# EAGLE design Sifteo Thundercracker Buddy Dev - SST (EAGLE 5.11)
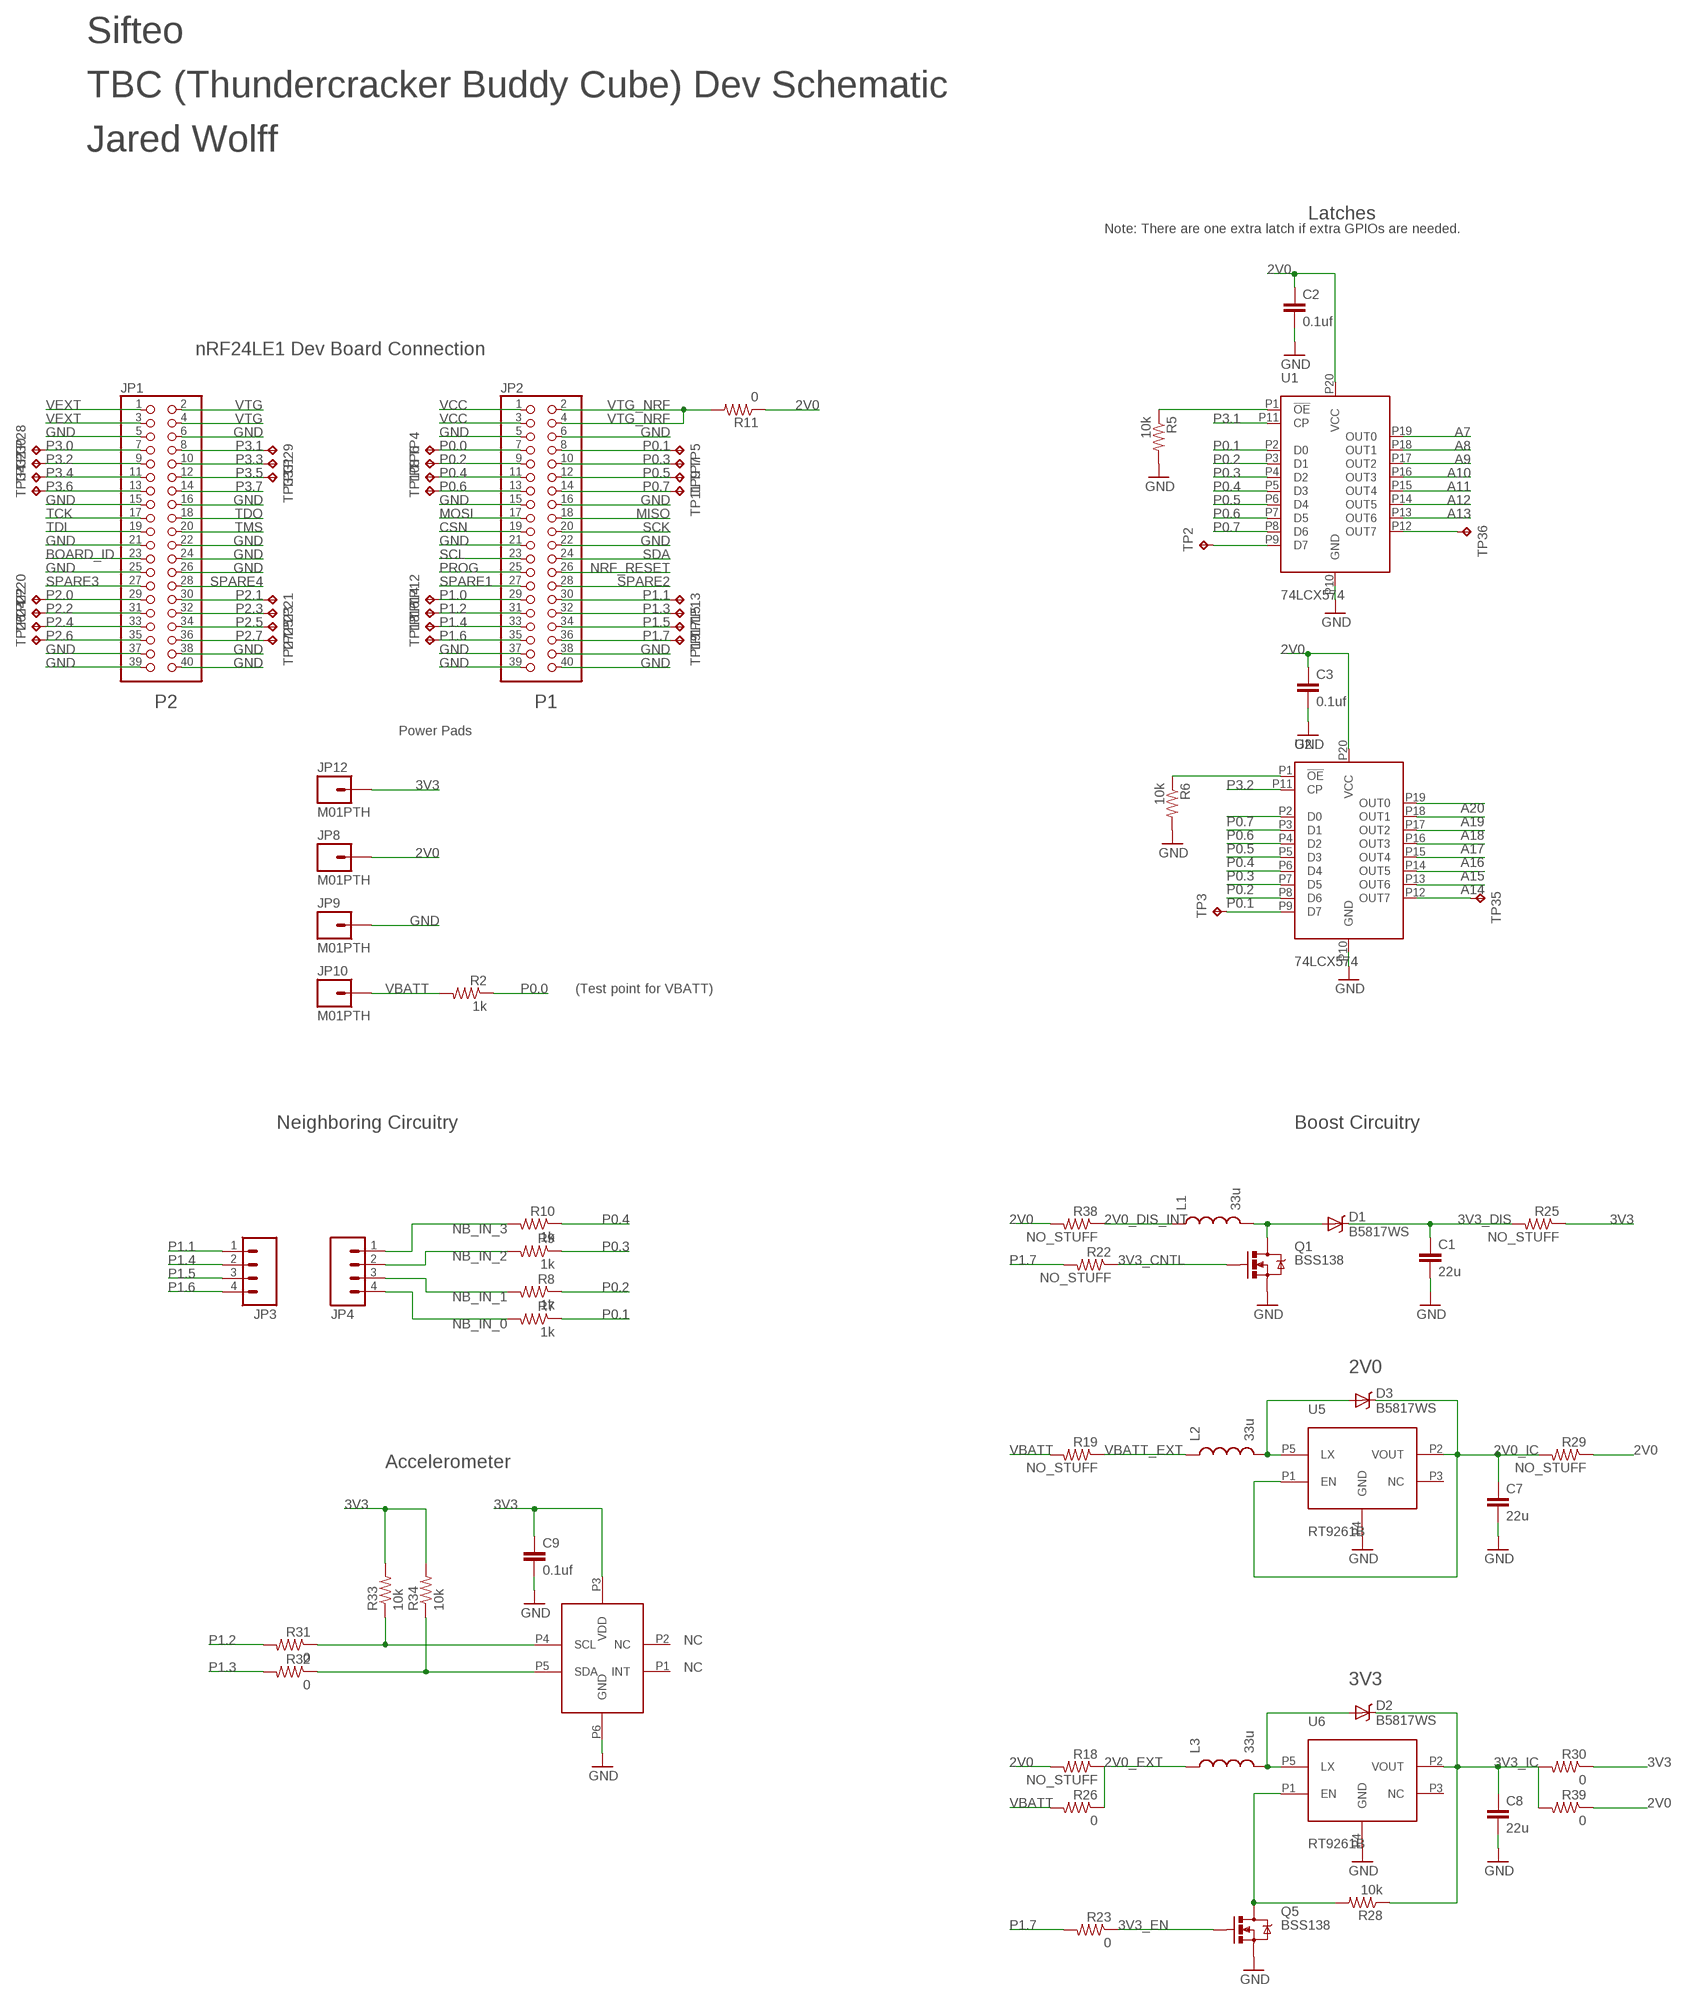
[diagram p0: schematic, sheet 1, part 1 of 2]
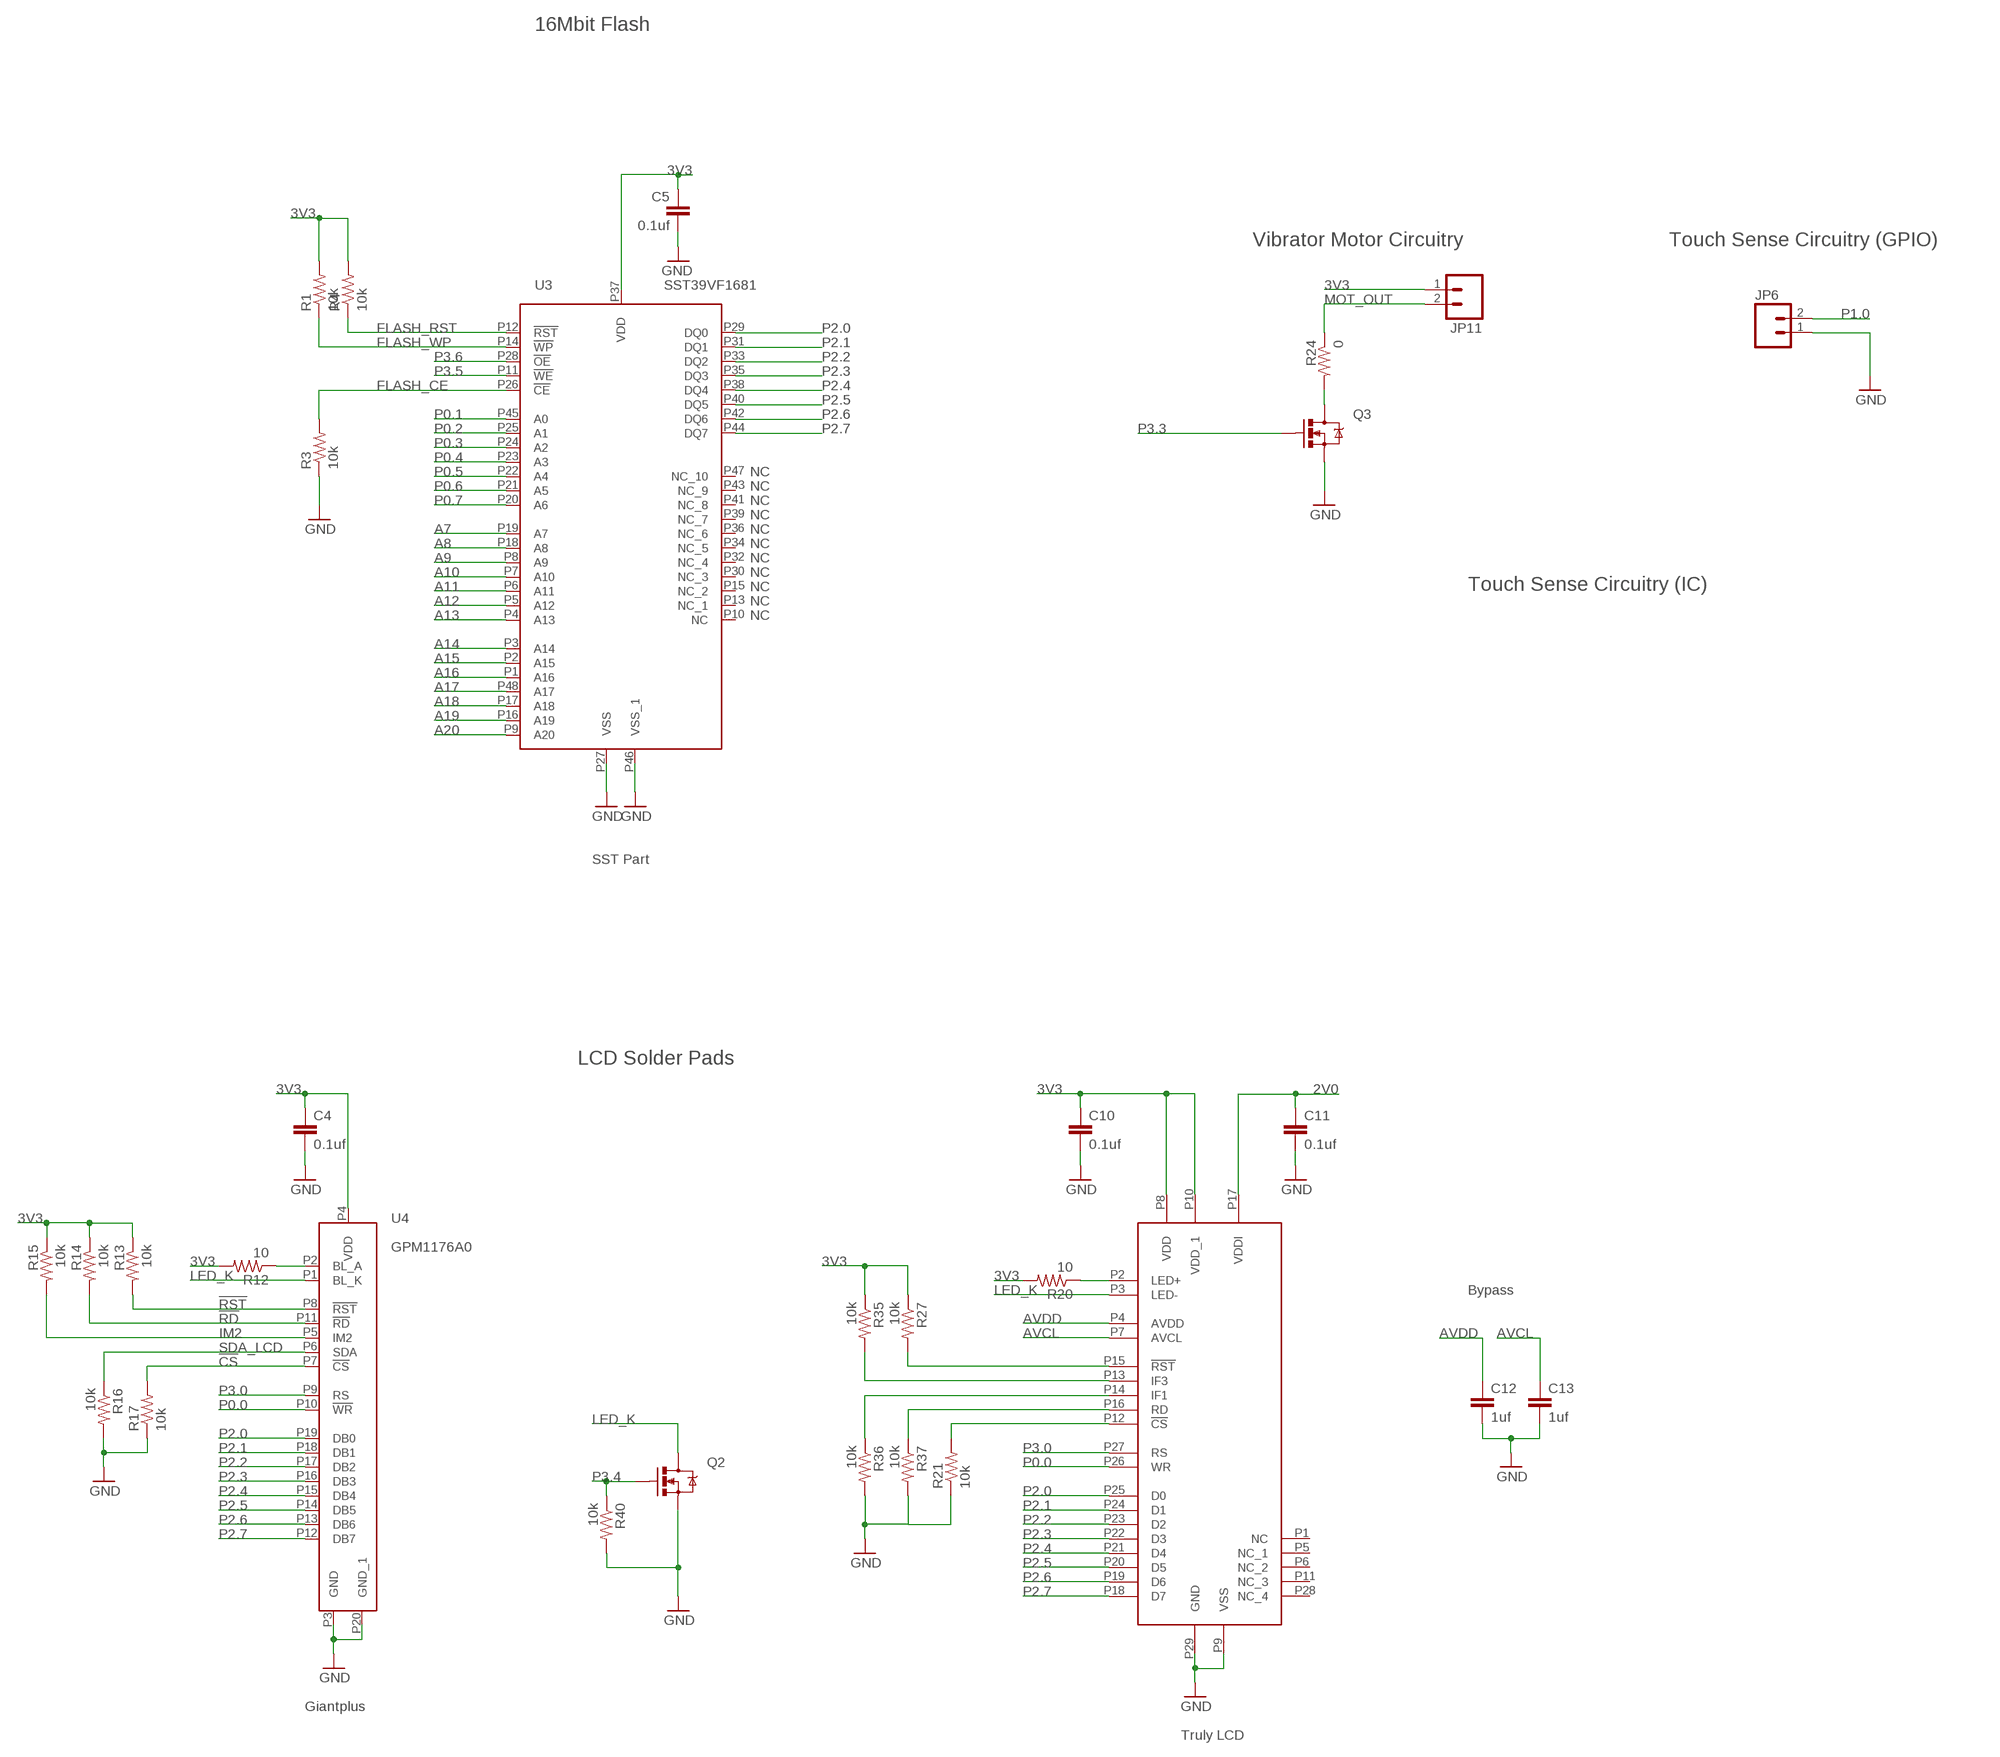
[diagram p1: schematic, sheet 1, part 2 of 2]

## Parts
C1  22u  CAP0603-CAP  [0603-CAP]
C2  0.1uf  CAP0402-CAP  [0402-CAP]
C3  0.1uf  CAP0402-CAP  [0402-CAP]
C4  0.1uf  CAP0402-CAP  [0402-CAP]
C5  0.1uf  CAP0402-CAP  [0402-CAP]
C7  22u  CAP0603-CAP  [0603-CAP]
C8  22u  CAP0603-CAP  [0603-CAP]
C9  0.1uf  CAP0402-CAP  [0402-CAP]
C10  0.1uf  CAP0402-CAP  [0402-CAP]
C11  0.1uf  CAP0402-CAP  [0402-CAP]
C12  1uf  CAP0402-CAP  [0402-CAP]
C13  1uf  CAP0402-CAP  [0402-CAP]
D1  B5817WS  [SOD-323]
D2  B5817WS  [SOD-323]
D3  B5817WS  [SOD-323]
JP1  PINHD-2X20  [2X20]
JP2  PINHD-2X20  [2X20]
JP3  M04PTH  [1X04]
JP4  M04PTH  [1X04]
JP6  M02PTH  [1X02]
JP8  M01PTH  [1X01]
JP9  M01PTH  [1X01]
JP10  M01PTH  [1X01]
JP11  M02PTH  [1X02]
JP12  M01PTH  [1X01]
L1  33u  INDUCTOR0805  [0805]
L2  33u  INDUCTOR0805  [0805]
L3  33u  INDUCTOR0805  [0805]
Q1  BSS138  MOSFET-NCHANNELSMD  [SOT23-3]
Q2  BSS138  MOSFET-NCHANNELSMD  [SOT23-3]
Q3  BSS138  MOSFET-NCHANNELSMD  [SOT23-3]
Q5  BSS138  MOSFET-NCHANNELSMD  [SOT23-3]
R1  10k  RESISTOR0603-RES  [0603-RES]
R2  1k  RESISTOR0603-RES  [0603-RES]
R3  10k  RESISTOR0603-RES  [0603-RES]
R4  10k  RESISTOR0603-RES  [0603-RES]
R5  10k  RESISTOR0603-RES  [0603-RES]
R6  10k  RESISTOR0603-RES  [0603-RES]
R7  1k  RESISTOR0603-RES  [0603-RES]
R8  1k  RESISTOR0603-RES  [0603-RES]
R9  1k  RESISTOR0603-RES  [0603-RES]
R10  1k  RESISTOR0603-RES  [0603-RES]
R11  0  RESISTOR0603-RES  [0603-RES]
R12  10  RESISTOR0603-RES  [0603-RES]
R13  10k  RESISTOR0603-RES  [0603-RES]
R14  10k  RESISTOR0603-RES  [0603-RES]
R15  10k  RESISTOR0603-RES  [0603-RES]
R16  10k  RESISTOR0603-RES  [0603-RES]
R17  10k  RESISTOR0603-RES  [0603-RES]
R18  NO_STUFF  RESISTOR0603-RES  [0603-RES]
R19  NO_STUFF  RESISTOR0603-RES  [0603-RES]
R20  10  RESISTOR0603-RES  [0603-RES]
R21  10k  RESISTOR0603-RES  [0603-RES]
R22  NO_STUFF  RESISTOR0603-RES  [0603-RES]
R23  0  RESISTOR0603-RES  [0603-RES]
R24  0  RESISTOR0603-RES  [0603-RES]
R25  NO_STUFF  RESISTOR0603-RES  [0603-RES]
R26  0  RESISTOR0603-RES  [0603-RES]
R27  10k  RESISTOR0603-RES  [0603-RES]
R28  10k  RESISTOR0603-RES  [0603-RES]
R29  NO_STUFF  RESISTOR0603-RES  [0603-RES]
R30  0  RESISTOR0603-RES  [0603-RES]
R31  0  RESISTOR0603-RES  [0603-RES]
R32  0  RESISTOR0603-RES  [0603-RES]
R33  10k  RESISTOR0603-RES  [0603-RES]
R34  10k  RESISTOR0603-RES  [0603-RES]
R35  10k  RESISTOR0603-RES  [0603-RES]
R36  10k  RESISTOR0603-RES  [0603-RES]
R37  10k  RESISTOR0603-RES  [0603-RES]
R38  NO_STUFF  RESISTOR0603-RES  [0603-RES]
R39  0  RESISTOR0603-RES  [0603-RES]
R40  10k  RESISTOR0603-RES  [0603-RES]
TP2  TPTP15R  [TP15R]
TP3  TPTP15R  [TP15R]
TP4  TPTP15R  [TP15R]
TP5  TPTP15R  [TP15R]
TP6  TPTP15R  [TP15R]
TP7  TPTP15R  [TP15R]
TP8  TPTP15R  [TP15R]
TP9  TPTP15R  [TP15R]
TP10  TPTP15R  [TP15R]
TP11  TPTP15R  [TP15R]
TP12  TPTP15R  [TP15R]
TP13  TPTP15R  [TP15R]
TP14  TPTP15R  [TP15R]
TP15  TPTP15R  [TP15R]
TP16  TPTP15R  [TP15R]
TP17  TPTP15R  [TP15R]
TP18  TPTP15R  [TP15R]
TP19  TPTP15R  [TP15R]
TP20  TPTP15R  [TP15R]
TP21  TPTP15R  [TP15R]
TP22  TPTP15R  [TP15R]
TP23  TPTP15R  [TP15R]
TP24  TPTP15R  [TP15R]
TP25  TPTP15R  [TP15R]
TP26  TPTP15R  [TP15R]
TP27  TPTP15R  [TP15R]
TP28  TPTP15R  [TP15R]
TP29  TPTP15R  [TP15R]
TP30  TPTP15R  [TP15R]
TP31  TPTP15R  [TP15R]
TP32  TPTP15R  [TP15R]
TP33  TPTP15R  [TP15R]
TP34  TPTP15R  [TP15R]
TP35  TPTP15R  [TP15R]
TP36  TPTP15R  [TP15R]
U1  74LCX574  [20-TSSOP-4.4MM]
U2  74LCX574  [20-TSSOP-4.4MM]
U3  SST39VF1681  [48-TSOP-12X20MM]
U4  GPM1176A0  [20-LCD-FLEX]
U5  RT9261B  [SOT-23-5]
U6  RT9261B  [SOT-23-5]
U7  DTOS-V005  [LCC6]
U8  TFT128128-102-E  [28-LCD-FLEX]

## Nets
2V0: C2.1 C3.1 C11.1 JP8.1 R11.1 R18.2 R29.1 R38.2 R39.1 U1.P20(VCC) U2.P20(VCC) U8.P17(VDDI)
2V0_DIS_INT: L1.1 R38.1
2V0_EXT: L3.1 R18.1 R26.1
2V0_IC: C7.1 D3.P2(C) R29.2 U5.P1(EN) U5.P2(VOUT)
3V3: C4.1 C5.1 C9.1 C10.1 JP11.1 JP12.1 R1.2 R4.2 R12.2 R13.1 R14.1 R15.1 R20.2 R25.1 R27.1 R30.1 R33.2 R34.2 R35.1 U3.P37(VDD) U4.P4(VDD) U7.P3(VDD) U8.P8(VDD) U8.P10(VDD_1)
3V3_CNTL: Q1.1(G) R22.1
3V3_DIS: C1.1 D1.P2(C) R25.2
3V3_EN: Q5.1(G) R23.1
3V3_IC: C8.1 D2.P2(C) R28.1 R30.2 R39.2 U6.P2(VOUT)
!CS: R17.2 U4.P7(!CS)
!RD: R14.2 U4.P11(!RD)
!RST: R13.2 U4.P8(!RST)
A7: U1.P19(OUT0) U3.P19(A7)
A8: U1.P18(OUT1) U3.P18(A8)
A9: U1.P17(OUT2) U3.P8(A9)
A10: U1.P16(OUT3) U3.P7(A10)
A11: U1.P15(OUT4) U3.P6(A11)
A12: U1.P14(OUT5) U3.P5(A12)
A13: U1.P13(OUT6) U3.P4(A13)
A14: U2.P13(OUT6) U3.P3(A14)
A15: U2.P14(OUT5) U3.P2(A15)
A16: U2.P15(OUT4) U3.P1(A16)
A17: U2.P16(OUT3) U3.P48(A17)
A18: U2.P17(OUT2) U3.P17(A18)
A19: U2.P18(OUT1) U3.P16(A19)
A20: U2.P19(OUT0) U3.P9(A20)
AVCL: C13.1 U8.P7(AVCL)
AVDD: C12.1 U8.P4(AVDD)
BOARD_ID: JP1.23
CSN: JP2.19
FLASH_CE: R3.2 U3.P26(!CE)
FLASH_RST: R4.1 U3.P12(!RST)
FLASH_WP: R1.1 U3.P14(!WP)
GND: C1.2 C2.2 C3.2 C4.2 C5.2 C7.2 C8.2 C9.2 C10.2 C11.2 C12.2 C13.2 JP1.5 JP1.6 JP1.15 JP1.16 JP1.21 JP1.22 JP1.24 JP1.25 JP1.26 JP1.37 JP1.38 JP1.39 JP1.40 JP2.5 JP2.6 JP2.15 JP2.16 JP2.21 JP2.22 JP2.37 JP2.38 JP2.39 JP2.40 JP6.1 JP9.1 Q1.2(S) Q2.2(S) Q3.2(S) Q5.2(S) R3.1 R5.2 R6.2 R16.2 R17.1 R21.1 R36.2 R37.2 R40.2 U1.P10(GND) U2.P10(GND) U3.P27(VSS) U3.P46(VSS_1) U4.P3(GND) U4.P20(GND_1) U5.P4(GND) U6.P4(GND) U7.P6(GND) U8.P9(VSS) U8.P29(GND)
IM2: R15.2 U4.P5(IM2)
LED_K: Q2.3(D) U4.P1(BL_K) U8.P3(LED-)
MISO: JP2.18
MOSI: JP2.17
MOT_OUT: JP11.2 R24.1
MOT_OUT_INT: Q3.3(D) R24.2
N$1: TP2.TP U1.P9(D7)
N$2: TP3.TP U2.P9(D7)
N$4: TP35.TP U2.P12(OUT7)
N$6: R5.1 U1.P1(!OE)
N$7: R21.2 U8.P12(!CS)
N$8: D3.P1(A) L2.2 U5.P5(LX)
N$9: R6.1 U2.P1(!OE)
N$10: D1.P1(A) L1.2 Q1.3(D)
N$11: R12.1 U4.P2(BL_A)
N$12: D2.P1(A) L3.2 U6.P5(LX)
N$13: Q5.3(D) R28.2 U6.P1(EN)
N$14: R32.1 R34.1 U7.P5(SDA)
N$15: R20.1 U8.P2(LED+)
N$16: R31.1 R33.1 U7.P4(SCL)
N$17: TP36.TP U1.P12(OUT7)
N$19: R27.2 U8.P15(!RST)
N$20: R35.2 U8.P13(IF3)
N$21: R36.1 U8.P14(IF1)
N$22: R37.1 U8.P16(RD)
NB_IN_0: JP4.4 R7.2
NB_IN_1: JP4.3 R8.2
NB_IN_2: JP4.2 R9.2
NB_IN_3: JP4.1 R10.2
NRF_RESET: JP2.26
P0.0: JP2.7 R2.1 TP4.TP U4.P10(!WR) U8.P26(WR)
P0.1: JP2.8 R7.1 TP5.TP U1.P2(D0) U2.P8(D6) U3.P45(A0)
P0.2: JP2.9 R8.1 TP6.TP U1.P3(D1) U2.P7(D5) U3.P25(A1)
P0.3: JP2.10 R9.1 TP7.TP U1.P4(D2) U2.P6(D4) U3.P24(A2)
P0.4: JP2.11 R10.1 TP8.TP U1.P5(D3) U2.P5(D3) U3.P23(A3)
P0.5: JP2.12 TP9.TP U1.P6(D4) U2.P4(D2) U3.P22(A4)
P0.6: JP2.13 TP10.TP U1.P7(D5) U2.P3(D1) U3.P21(A5)
P0.7: JP2.14 TP11.TP U1.P8(D6) U2.P2(D0) U3.P20(A6)
P1.0: JP2.29 JP6.2 TP12.TP
P1.1: JP2.30 JP3.1 TP13.TP
P1.2: JP2.31 R31.2 TP14.TP
P1.3: JP2.32 R32.2 TP15.TP
P1.4: JP2.33 JP3.2 TP16.TP
P1.5: JP2.34 JP3.3 TP17.TP
P1.6: JP2.35 JP3.4 TP18.TP
P1.7: JP2.36 R22.2 R23.2 TP19.TP
P2.0: JP1.29 TP20.TP U3.P29(DQ0) U4.P19(DB0) U8.P25(D0)
P2.1: JP1.30 TP21.TP U3.P31(DQ1) U4.P18(DB1) U8.P24(D1)
P2.2: JP1.31 TP22.TP U3.P33(DQ2) U4.P17(DB2) U8.P23(D2)
P2.3: JP1.32 TP23.TP U3.P35(DQ3) U4.P16(DB3) U8.P22(D3)
P2.4: JP1.33 TP24.TP U3.P38(DQ4) U4.P15(DB4) U8.P21(D4)
P2.5: JP1.34 TP25.TP U3.P40(DQ5) U4.P14(DB5) U8.P20(D5)
P2.6: JP1.35 TP26.TP U3.P42(DQ6) U4.P13(DB6) U8.P19(D6)
P2.7: JP1.36 TP27.TP U3.P44(DQ7) U4.P12(DB7) U8.P18(D7)
P3.0: JP1.7 TP28.TP U4.P9(RS) U8.P27(RS)
P3.1: JP1.8 TP29.TP U1.P11(CP)
P3.2: JP1.9 TP30.TP U2.P11(CP)
P3.3: JP1.10 Q3.1(G) TP31.TP
P3.4: JP1.11 Q2.1(G) R40.1 TP32.TP
P3.5: JP1.12 TP33.TP U3.P11(!WE)
P3.6: JP1.13 TP34.TP U3.P28(!OE)
P3.7: JP1.14
PROG: JP2.25
SCK: JP2.20
SCL: JP2.23
SDA: JP2.24
SDA_LCD: R16.1 U4.P6(SDA)
SPARE1: JP2.27
SPARE2: JP2.28
SPARE3: JP1.27
SPARE4: JP1.28
TCK: JP1.17
TDI: JP1.19
TDO: JP1.18
TMS: JP1.20
VBATT: JP10.1 R2.2 R19.2 R26.2
VBATT_EXT: L2.1 R19.1
VCC: JP2.1 JP2.3
VEXT: JP1.1 JP1.3
VTG: JP1.2 JP1.4
VTG_NRF: JP2.2 JP2.4 R11.2
Unconnected: U3.P10(NC) U3.P13(NC_1) U3.P15(NC_2) U3.P30(NC_3) U3.P32(NC_4) U3.P34(NC_5) U3.P36(NC_6) U3.P39(NC_7) U3.P41(NC_8) U3.P43(NC_9) U3.P47(NC_10) U5.P3(NC) U6.P3(NC) U7.P1(INT) U7.P2(NC) U8.P1(NC) U8.P5(NC_1) U8.P6(NC_2) U8.P11(NC_3) U8.P28(NC_4)

## Notes on the sheet
- Sifteo
- TBC (Thundercracker Buddy Cube) Dev Schematic
- Jared Wolff
- Latches | 16Mbit Flash
- Note: There are one extra latch if extra GPIOs are needed.
- nRF24LE1 Dev Board Connection
- Vibrator Motor Circuitry | Touch Sense Circuitry (GPIO)
- NC
- NC
- NC
- NC
- NC
- P2 | P1 | NC
- NC
- Power Pads | NC
- NC | Touch Sense Circuitry (IC)
- NC
- NC
- (Test point for VBATT)
- SST Part
- Neighboring Circuitry | Boost Circuitry
- LCD Solder Pads
- 2V0
- Bypass
- Accelerometer
- NC
- NC
- 3V3
- Giantplus
- Truly LCD

## Library data of the parts
C1-C5 C7-C13 = SparkFun:CAP: Capacitor Standard 0603 ceramic capacitor, and 0.1" leaded capacitor.
D1-D3 = Sifteo:B5817WS: All prices are in US dollars. Digi-Key Part Number B5817WS-TPMSCT-ND Price Break Unit Price Extended Price 1 0.53000 0.53 10 0.38000 3.80 100 0.22800 22.80 250 0.16152 40.38 500 0.12920 64.60 1,000 0.09880 98.80 Quantity Available 20,155 Note <http://ordering.digikey.com/Help.aspx?id=Quantity%20Available%20Note&site=US&lang=EN> Manufacturer Micro Commercial Co <http://digikey.com/Suppliers/us/Micro-Commercial-Components.page?lang=EN> Manufacturer Part Number B5817WS-TP Description DIODE SCHOTTKY 1A 20V SOD-323 Lead Free Status / RoHS Status Lead free / RoHS Compliant Datasheets B5817-19WS <http://61.222.192.61/mccsemi/up_pdf/B5817WS-B5819WS(SOD-323).PDF> Product Photos SOD-323 <http://media.digikey.com/Renders/Micro%20Commercial%20Renders/SOD-323.jpg> Product Training Modules Diode Handling and Mounting <http://digikey.com/PTM/IndividualPTM.page?site=us&lang=en&ptm=24932&WT.pn_sku=B5817WS-TPMSCT-ND&WT.z_ptm_source=Part_Detail> Catalog Drawings MCC Diode SOD-323 Pkg <http://media.digikey.com/pdf/Catalog%20Drawings/Diodes/BAV19WS_1-v1.jpg> Standard Package <http://dkc1.digikey.com/US/EN/help/help14.html> 1 Category Discrete Semiconductor Products Family Diodes, Rectifiers - Single Series - Diode Type Schottky Voltage - DC Reverse (Vr) (Max) 20V Current - Average Rectified (Io) 1A Voltage - Forward (Vf) (Max) @ If 450mV @ 1A Speed Fast Recovery =< 500ns, > 200mA (Io) Reverse Recovery Time (trr) - Current - Reverse Leakage @ Vr 1mA @ 20V Capacitance @ Vr, F - Mounting Type Surface Mount Package / Case SOD-323-2 Supplier Device Package SOD-323 Packaging <http://dkc1.digikey.com/US/EN/help/help14.html> Cut Tape (CT) Catalog Page 1411 (US2011 Interactive) <http://onlinecatalog.digikey.com/?pagelabel=1411> 1411 (US2011 PDF) <http://dkc3.digikey.com/PDF/US2011/P1411.pdf> Other Names B5817WS-TPMSCT
JP1 JP2 = pinhead:PINHD-2X20: PIN HEADER
JP3 JP4 = SparkFun:M04: Header 4 Standard 4-pin 0.1" header. Use with straight break away headers (SKU : PRT-00116), right angle break away headers (PRT-00553), swiss pins (PRT-00743), machine pins (PRT-00117), and female headers (PRT-00115). Molex polarized connector foot print use with SKU : PRT-08231 with associated crimp pins and housings. 1MM SMD Version SKU: PRT-10208
JP6 JP11 = SparkFun:M02: Header 2 Standard 2-pin 0.1" header. Use with straight break away headers (SKU : PRT-00116), right angle break away headers (PRT-00553), swiss pins (PRT-00743), machine pins (PRT-00117), and female headers (PRT-00115). Molex polarized connector foot print use with SKU : PRT-08233 with associated crimp pins and housings.
JP8-JP10 JP12 = SparkFun:M01: Header 1 Standard 1-pin 0.1" header. Use with straight break away headers (SKU : PRT-00116), right angle break away headers (PRT-00553), swiss pins (PRT-00743), machine pins (PRT-00117), and female headers (PRT-00115).
L1-L3 = SparkFun:INDUCTOR: Inductors Basic Inductor/Choke - 0603 and 1206. Footprints are not proven and vary greatly between part numbers.
Q1-Q3 Q5 = SparkFun:MOSFET-NCHANNEL
R1-R40 = SparkFun:RESISTOR: Resistor Basic schematic elements and footprints for 0603, 1206, and PTH resistors.
TP2-TP36 = testpad:TP: Test pad
U1 U2 = Sifteo:74LCX574: All prices are in US dollars. Digi-Key Part Number 74LCX574MTCXCT-ND Price Break Unit Price Extended Price 1 0.70000 0.70 25 0.48920 12.23 100 0.41940 41.94 250 0.36224 90.56 500 0.31140 155.70 1,000 0.24149 241.49 Quantity Available 74,542 Note <http://ordering.digikey.com/Help.aspx?id=Quantity%20Available%20Note&site=US&lang=EN> Manufacturer Fairchild Semiconductor <http://digikey.com/Suppliers/us/Fairchild-Semiconductor.page?lang=EN> Manufacturer Part Number 74LCX574MTCX Description IC FLIP FLOP DTYPE OCT 20TSSOP Lead Free Status / RoHS Status Lead free / RoHS Compliant Datasheets 74LCX574 <http://www.fairchildsemi.com/ds/74/74LCX574.pdf> Product Photos 20-TSSOP Pkg <http://media.digikey.com/photos/Fairchild%20Semi%20Photos/261-20-TSSOP.jpg> 20-TSSOP <http://media.digikey.com/Renders/~~Pkg.Case%20or%20Series/20-TSSOP%20(0.173,%204.40mm%20Width).jpg> Standard Package <http://dkc1.digikey.com/US/EN/help/help14.html> 1 Category Integrated Circuits (ICs) Family Logic - Flip Flops Series 74LCX Function Standard Type D-Type Bus Output Type Tri-State Non Inverted Number of Elements 1 Number of Bits per Element 8 Frequency - Clock 150MHz Delay Time - Propagation 8.5ns Trigger Type Positive Edge Current - Output High, Low 24mA, 24mA Voltage - Supply 2 V ~ 3.6 V Operating Temperature -40°C ~ 85°C Mounting Type Surface Mount Package / Case 20-TSSOP (0.173", 4.40mm Width) Packaging <http://dkc1.digikey.com/US/EN/help/help14.html> Cut Tape (CT) Catalog Page 1103 (US2011 Interactive) <http://onlinecatalog.digikey.com/?pagelabel=1103> 1103 (US2011 PDF) <http://dkc3.digikey.com/PDF/US2011/P1103.pdf> Other Names 74LCX574MTCXCT
U3 = Sifteo:SST39VF1681: All prices are in US dollars. Digi-Key Part Number SST39VF1681-70-4C-EKE-ND Price Break Unit Price Extended Price 1 3.56000 3.56 10 2.97000 29.70 25 2.82000 70.50 100 2.69000 269.00 Quantity Available 105 Manufacturer Microchip Technology <http://digikey.com/Suppliers/us/Microchip-Technology.page?lang=EN> Manufacturer Part Number SST39VF1681-70-4C-EKE Description IC FLASH MPF 16MBIT 70NS 48TSOP Lead Free Status / RoHS Status Lead free / RoHS Compliant Datasheets SST39 Series Brochure <http://ww1.microchip.com/downloads/en/DeviceDoc/01360A.pdf> SST39VF1681, 1682 <http://ww1.microchip.com/downloads/en/DeviceDoc/25040A.pdf> Product Photos 48-TSOP <http://media.digikey.com/Renders/Microchip%20Tech%20Renders/48-TSOP.jpg> Featured Product SST Serial and Parallel Flash Memory <http://www.digikey.com/product-highlights/us/en/microchip-sst-serial-parallel-flash-memory/4> Standard Package <http://dkc1.digikey.com/US/EN/help/help14.html> 96 Category Integrated Circuits (ICs) Family Memory Series - Format - Memory FLASH Memory Type FLASH Memory Size 16M (2M x 8) Speed 70ns Interface Parallel Voltage - Supply 2.7 V ~ 3.6 V Operating Temperature 0°C ~ 70°C Package / Case 48-TFSOP (0.472", 12.00mm Width) Supplier Device Package 48-TSOP Packaging <http://dkc1.digikey.com/US/EN/help/help14.html> Tray Catalog Page 1233 (US2011 Interactive) <http://onlinecatalog.digikey.com/?pagelabel=1233> 1233 (US2011 PDF) <http://dkc3.digikey.com/PDF/US2011/P1233.pdf>
U4 = Sifteo:GPM1176A0: Giantplus Technology GPM1176A0 1.52 Strip TFT LCD Module ROHS Compliant Description: The GPM1176A0 model is a Color TFT LCD supplied by Giantplus. This main Module has an 1.52 inch diagonally measured active display area with 128 X RGB X 128 resolution. Each pixel is divided into Red, Green and Blue sub-pixels and dots which are arranged in vertical stripes. LCD color is determined with Dithering 262K/65K/4K Color signal for each pixel. The GPM1176A0 has been designed to apply the interface method that enables low power, high speed, and high contrast. The GPM1176A0 is intended to support applications where thin thickness, wide viewing angle, low power are critical factors and graphic displays are important.
U5 U6 = Sifteo:RT9261B: RT9261B General Description The RT9261B Series are VFM Step-up DC/DC converter ICs with ultra low supply current by CMOS process and suitable for use with battery-powered instruments. The RT9261B IC consists of an oscillator, a VFM control circuit, a driver transistor (LX switch), a reference voltage unit, an error amplifier, resistors for voltage detection, and a LX switch protection circuit. A low ripple and high efficiency step-up DC/DC converter can be constructed with the RT9261B IC and only three external components. The EN pin enables the circuit to set the standby supply current at a maximum of 0.5?A.<
U7 = Sifteo:DTOS-V005
U8 = Sifteo:TFT128128-102-E: Truly LCD Module Model Number: TFT128128-102-E

## Board
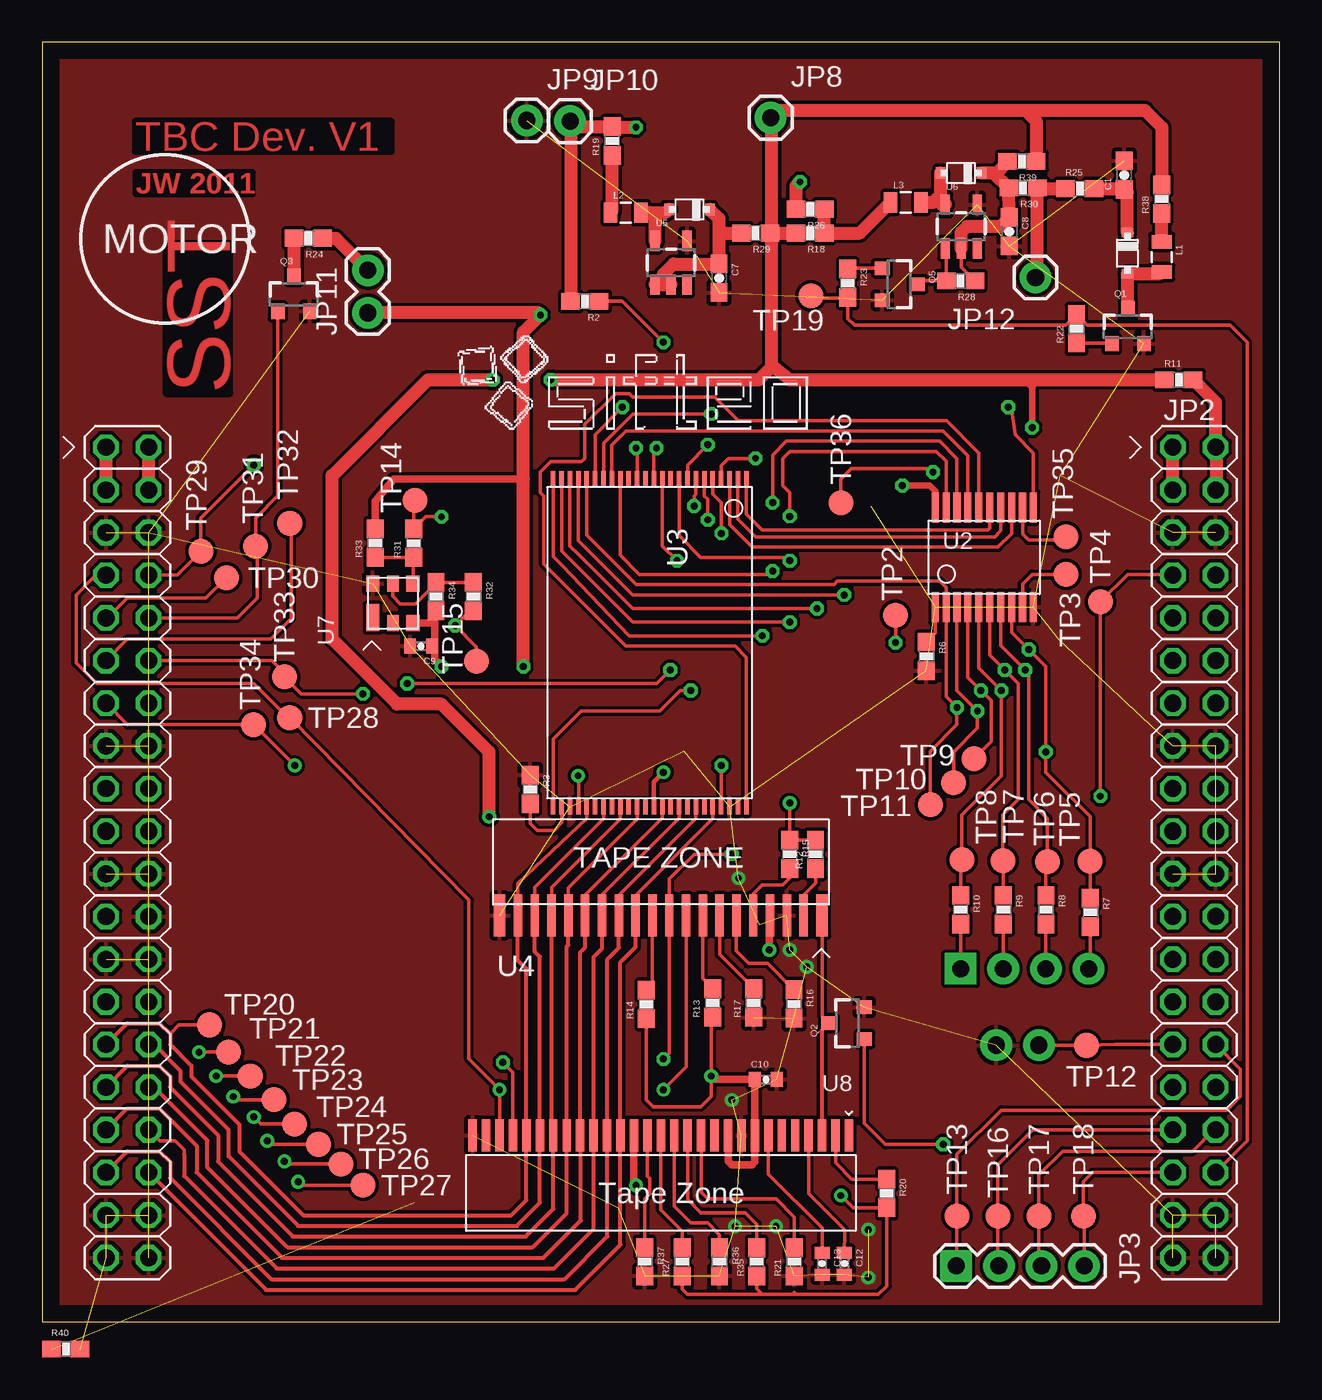
[diagram p2: board, top side]
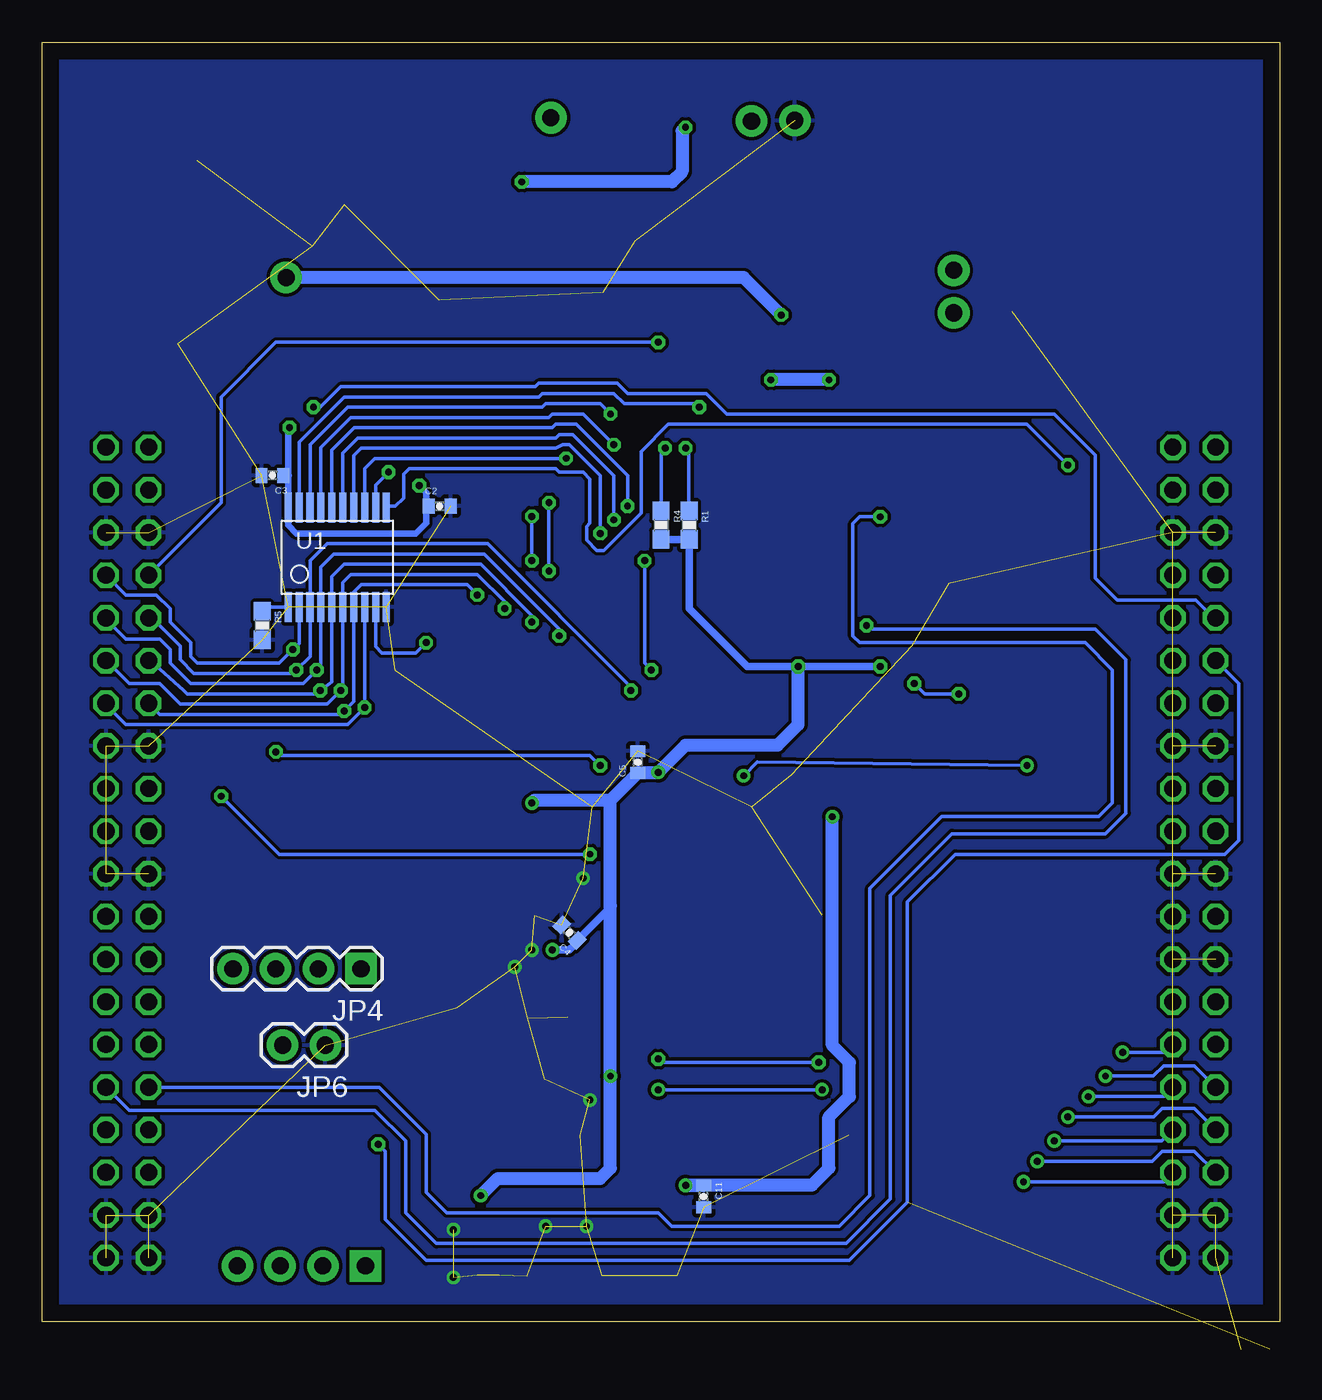
[diagram p3: board, bottom side, seen from below]

Size 73.66 x 76.2 mm. Coordinates in mm from the lower left corner, seen from the top.
Outline: 0,0 73.66,0 73.66,76.2 0,76.2 0,0
Copper layers (1*16): Top 0.035mm / dielectric 1.5mm / Bottom 0.035mm
Design rules "default *": minimum track width 8mil, minimum drill 16mil, track to track 8mil, track to pad 8mil, pad to pad 8mil, via to via 8mil, smd to smd 8mil, copper to edge 40mil, drill to drill 8mil, minimum pad ring 10mil, minimum via ring 8mil, stop-mask expansion 4mil, vias tented up to drill 0mil, thermal gap 10mil

### Footprints (pad centres in the part's own frame; a part is rotated, then mirrored left to right if it is on the bottom)
0603-CAP = smd 1.1 x 1: 1 -0.85,0; 2 0.85,0
0402-CAP = smd 0.7 x 0.9: 1 -0.65,0; 2 0.65,0
SOD-323 = smd 0.559 x 0.686: P1 -1.219,0; P2 1.219,0
2X20 = drill 1.016 octagon: 1 -24.13,-1.27; 2 -24.13,1.27; 3 -21.59,-1.27; 4 -21.59,1.27; 5 -19.05,-1.27; 6 -19.05,1.27; 7 -16.51,-1.27; 8 -16.51,1.27; 9 -13.97,-1.27; 10 -13.97,1.27; 11 -11.43,-1.27; 12 -11.43,1.27; 13 -8.89,-1.27; 14 -8.89,1.27; 15 -6.35,-1.27; 16 -6.35,1.27; 17 -3.81,-1.27; 18 -3.81,1.27; 19 -1.27,-1.27; 20 -1.27,1.27; 21 1.27,-1.27; 22 1.27,1.27; 23 3.81,-1.27; 24 3.81,1.27; 25 6.35,-1.27; 26 6.35,1.27; 27 8.89,-1.27; 28 8.89,1.27; 29 11.43,-1.27; 30 11.43,1.27; 31 13.97,-1.27; 32 13.97,1.27; 33 16.51,-1.27; 34 16.51,1.27; 35 19.05,-1.27; 36 19.05,1.27; 37 21.59,-1.27; 38 21.59,1.27; 39 24.13,-1.27; 40 24.13,1.27
1X04 = drill 1.016 pad 1.88 square: 1 0,0 | drill 1.016 pad 1.88 round: 2 2.54,0; 3 5.08,0; 4 7.62,0
1X02 = drill 1.016 pad 1.88 round: 1 0,0; 2 2.54,0
1X01 = drill 1.016 pad 1.88 round: 1 0,0
0805 = smd 0.8 x 1.2: 1 -0.9,0; 2 0.9,0
SOT23-3 = smd 0.8 x 0.9: 1 -0.95,-1; 2 0.95,-1; 3 0,1.1
0603-RES = smd 1.1 x 1: 1 -0.85,0; 2 0.85,0
TP15R = smd 1.5 x 1.5: TP 0,0
20-TSSOP-4.4MM = smd 0.42 x 1.78: P1 -2.925,-2.97; P2 -2.275,-2.97; P3 -1.625,-2.97; P4 -0.975,-2.97; P5 -0.325,-2.97; P6 0.325,-2.97; P7 0.975,-2.97; P8 1.625,-2.97; P9 2.275,-2.97; P10 2.925,-2.97; P11 2.925,2.97; P12 2.275,2.97; P13 1.625,2.97; P14 0.975,2.97; P15 0.325,2.97; P16 -0.325,2.97; P17 -0.975,2.97; P18 -1.625,2.97; P19 -2.275,2.97; P20 -2.925,2.97
48-TSOP-12X20MM = smd 0.9 x 0.27: P1 -9.775,5.75; P2 -9.775,5.25; P3 -9.775,4.75; P4 -9.775,4.25; P5 -9.775,3.75; P6 -9.775,3.25; P7 -9.775,2.75; P8 -9.775,2.25; P9 -9.775,1.75; P10 -9.775,1.25; P11 -9.775,0.75; P12 -9.775,0.25; P13 -9.775,-0.25; P14 -9.775,-0.75; P15 -9.775,-1.25; P16 -9.775,-1.75; P17 -9.775,-2.25; P18 -9.775,-2.75; P19 -9.775,-3.25; P20 -9.775,-3.75; P21 -9.775,-4.25; P22 -9.775,-4.75; P23 -9.775,-5.25; P24 -9.775,-5.75; P25 9.775,-5.75; P26 9.775,-5.25; P27 9.775,-4.75; P28 9.775,-4.25; P29 9.775,-3.75; P30 9.775,-3.25; P31 9.775,-2.75; P32 9.775,-2.25; P33 9.775,-1.75; P34 9.775,-1.25; P35 9.775,-0.75; P36 9.775,-0.25; P37 9.775,0.25; P38 9.775,0.75; P39 9.775,1.25; P40 9.775,1.75; P41 9.775,2.25; P42 9.775,2.75; P43 9.775,3.25; P44 9.775,3.75; P45 9.775,4.25; P46 9.775,4.75; P47 9.775,5.25; P48 9.775,5.75
20-LCD-FLEX = smd 0.7 x 2.5: P1 9.6,-3.81; P20 -9.6,-3.81 | smd 0.5 x 2.5: P2 8.5,-3.81; P3 7.5,-3.81; P4 6.5,-3.81; P5 5.5,-3.81; P6 4.5,-3.81; P7 3.5,-3.81; P8 2.5,-3.81; P9 1.5,-3.81; P10 0.5,-3.81; P11 -0.5,-3.81; P12 -1.5,-3.81; P13 -2.5,-3.81; P14 -3.5,-3.81; P15 -4.5,-3.81; P16 -5.5,-3.81; P17 -6.5,-3.81; P18 -7.5,-3.81; P19 -8.5,-3.81
SOT-23-5 = smd 0.55 x 1.2: P1 -0.95,-1.3; P2 0,-1.3; P3 0.95,-1.3; P4 0.95,1.3; P5 -0.95,1.3
LCC6 = smd 1.6 x 0.8: P1 -0.85,1.2 | smd 0.95 x 0.7: P2 -1.175,0; P5 1.175,0 | smd 0.95 x 0.8: P3 -1.175,-1.2; P4 1.175,-1.2; P6 1.175,1.2
28-LCD-FLEX = smd 0.5 x 1.9: P1 -11.2,0; P2 -10.4,0; P3 -9.6,0; P4 -8.8,0; P5 -8,0; P6 -7.2,0; P7 -6.4,0; P8 -5.6,0; P9 -4.8,0; P10 -4,0; P11 -3.2,0; P12 -2.4,0; P13 -1.6,0; P14 -0.8,0; P15 0,0; P16 0.8,0; P17 1.6,0; P18 2.4,0; P19 3.2,0; P20 4,0; P21 4.8,0; P22 5.6,0; P23 6.4,0; P24 7.2,0; P25 8,0; P26 8.8,0; P27 9.6,0; P28 10.4,0; P29 11.2,0

### Placement (x,y rotation side)
C1  64.41,68.28 90 top
C2  49.99,48.56 0 bottom
C3  59.94,50.39 180 bottom
C4  42.27,23.16 135 bottom
C5  38.2,33.32 90 bottom
C7  40.3,62.13 270 top
C8  57.57,64.9 270 top
C9  22.56,40.23 180 top
C10  43.08,14.43 0 top
C11  34.28,7.47 270 bottom
C12  47.75,3.45 270 top
C13  46.43,3.45 270 top
D1  64.6,63.63 90 top
D2  54.7,68.4 0 top
D3  38.53,66.23 0 top
JP1  5.08,27.94 270 top
JP2  68.58,27.94 270 top
JP3  54.41,3.33 0 top
JP4  54.67,21.02 180 bottom
JP6  56.79,16.47 180 bottom
JP8  43.37,71.69 0 top
JP9  28.85,71.53 0 top
JP10  31.43,71.49 0 top
JP11  19.39,60.07 90 top
JP12  59.13,62.18 180 top
L1  66.65,63.4 270 top
L2  34.75,66.04 0 top
L3  51.41,66.65 0 top
Q1  64.63,59.23 0 top
Q2  47.94,17.78 90 top
Q3  14.99,61.16 0 top
Q5  51,61.77 270 top
R1  35.14,47.43 270 bottom
R2  32.31,60.76 180 top
R3  29.06,31.7 270 top
R4  36.82,47.43 270 bottom
R5  60.55,41.45 270 bottom
R6  52.63,39.62 270 top
R7  62.4,24.38 270 top
R8  59.75,24.54 270 top
R9  57.21,24.54 270 top
R10  54.67,24.54 270 top
R11  67.67,56.08 0 top
R12  46.04,27.84 90 top
R13  39.93,18.99 90 top
R14  35.97,18.9 90 top
R15  44.5,27.84 270 top
R16  44.75,18.92 270 top
R17  42.35,18.99 90 top
R18  45.72,64.82 180 top
R19  33.93,70.31 90 top
R20  50.28,7.65 270 top
R21  44.77,3.58 90 top
R22  61.57,59.13 90 top
R23  47.96,61.84 270 top
R24  15.85,64.52 180 top
R25  61.77,67.46 0 top
R26  45.72,66.24 180 top
R27  38.1,3.58 90 top
R28  54.67,61.98 180 top
R29  42.47,64.82 180 top
R30  58.39,67.51 180 top
R31  22.13,46.35 90 top
R32  25.67,43.18 270 top
R33  19.83,46.37 90 top
R34  23.45,43.18 270 top
R35  42.55,3.58 90 top
R36  40.32,3.58 270 top
R37  35.88,3.58 270 top
R38  66.65,66.85 90 top
R39  58.32,69.09 180 top
R40  1.42,-1.63 0 top
TP2  50.8,42.06 0 top
TP3  60.96,44.5 0 top
TP4  62.99,42.88 0 top
TP5  62.38,27.43 270 top
TP6  59.83,27.4 270 top
TP7  57.19,27.45 270 top
TP8  54.75,27.5 270 top
TP9  55.47,33.53 270 top
TP10  54.25,32.11 270 top
TP11  52.87,30.78 270 top
TP12  62.18,16.46 270 top
TP13  54.46,6.3 90 top
TP14  22.2,48.91 90 top
TP15  25.86,39.33 90 top
TP16  56.9,6.3 90 top
TP17  59.33,6.3 90 top
TP18  61.98,6.3 0 top
TP19  45.77,61.07 180 top
TP20  9.96,17.68 180 top
TP21  11.1,16.07 180 top
TP22  12.4,14.63 180 top
TP23  13.82,13.22 180 top
TP24  15.04,11.79 180 top
TP25  16.46,10.57 180 top
TP26  17.81,9.4 180 top
TP27  19.1,8.13 0 top
TP28  14.74,35.97 0 top
TP29  9.46,45.87 0 top
TP30  10.97,44.3 0 top
TP31  12.71,46.18 0 top
TP32  14.74,47.55 0 top
TP33  14.43,38.4 0 top
TP34  12.6,35.56 0 top
TP35  60.96,46.74 0 top
TP36  47.55,48.77 0 top
U1  56.08,45.52 0 bottom
U2  56.08,45.52 0 top
U3  36.17,40.44 270 top
U4  36.83,28.02 0 top
U5  37.44,63.06 0 top
U6  54.71,65.21 0 top
U7  20.88,42.77 90 top
U8  36.83,11.11 180 top

### Tracks (layer width: path | path; a pad name or v marks a point on that pad's centre or on a via)
2V0  (via drill 0.41)
  Top 0.203: 26.82,29.87 v26.62,30.07 26.62,30.28 | 26.62,31.29 26.78,31.13
  Top 0.381: U2.P20 53.16,49.46 52.83,49.78 v51.21,49.78 | 58.93,55.68 v58.93,53.24
  Top 0.457: U8.P17 35.23,8.26 v35.36,8.13 | 58.52,56.08 58.93,55.68
  Top 0.762: R11.1 58.52,56.08 44.5,56.08 43.48,56.9 | 43.45,56.86 43.48,56.9 | 26.62,30.28 26.62,31.29 26.62,33.93 23.77,36.78 21.13,36.78 17.27,40.64 17.27,50.39 22.96,56.08 v26.82,56.08 | v30.28,56.08 42.67,56.08 43.45,56.86 | 43.48,56.9 43.45,56.93 | R38.2 66.65,71.12 65.63,72.14 58.52,72.14 | 58.52,72.14 43.81,72.14 JP8.1 43.45,71.61 43.45,64.62 | 43.45,64.62 43.32,64.75 R29.1 R18.2 | 43.45,56.86 43.45,64.62 | R39.1 59.17,71.49 58.52,72.14
  Bottom 0.381: 50.8,48.56 50.8,47.55 51.41,46.94 58.52,46.94 59.01,47.43 U1.P20 59.01,50.39 59.01,53.16 | 50.8,48.56 50.8,49.38 v51.21,49.78 | 50.8,48.56 C2.1
  Bottom 0.457: 59.01,50.39 C3.1 | v58.93,53.24 59.01,53.16
  Bottom 0.762: v26.62,30.07 26.62,16.46 25.6,15.44 25.6,13.41 26.82,12.19 26.82,9.14 27.84,8.13 v35.36,8.13 35.35,8.12 C11.1 | v26.82,56.08 v30.28,56.08
2V0_DIS_INT
  Top 0.762: L1.1 R38.1
2V0_EXT
  Top 0.762: L3.1 48.68,64.82 R18.1 R26.1
2V0_IC
  Top 0.762: U5.P2 U5.P1 36.98,62.25 36.98,62.38 37.58,62.98 C7.1 40.3,64.82 | 40.3,64.82 40.3,65.68 D3.P2 | 40.3,64.82 R29.2
3V3  (via drill 0.41)
  Top 0.203: 23.37,41.84 23.12,41.6 | R27.1 38.1,1.93 38.41,1.63 42.88,1.63 | 42.88,1.63 44.91,1.63 | 44.91,1.63 49.78,1.63 50.28,2.12 R20.2 48.27,6.79 v47.55,7.52 | R35.1 42.55,1.96 42.88,1.63 | 44.91,1.63 44.77,1.76 | R13.1 39.83,18.04 v39.83,14.63 39.83,13.41 39.22,12.8 36.37,12.8 35.97,13.21 R14.1 | v44.5,30.89 R15.1 R12.2 | C9.1 23.2,40.19 23.37,40.03
  Top 0.254: U3.P37 36.42,32.15 v36.98,32.72
  Top 0.457: U8.P10 40.83,9.56 41.05,9.35 42.27,9.35 42.43,9.51 U8.P8 C10.1 40.03,14.43 v39.83,14.63 | U4.P4 43.28,24.08 v43.28,22.15 | v23.77,39.01 23.37,39.42 23.37,40.03 23.37,41.84 R34.2 23.12,41.6 U7.P3 | 19.91,47.12 19.83,47.2 R33.2 19.83,48.86 20.93,50.19 28.65,50.19
  Top 0.762: v28.65,39.01 28.65,50.19 28.65,58.93 v29.67,59.94 29.54,60.07 JP11.1 | JP12.1 59.24,62.29 R30.1 59.3,67.46 R25.1
  Bottom 0.381: C5.1 38,32.72
  Bottom 0.457: v43.28,22.15 42.27,22.15 41.96,22.45 41.96,22.55 C4.1 39.83,24.68 39.83,24.79 | R4.2 R1.2 35.15,42.46 31.7,39.01 v28.65,39.01 v23.77,39.01
  Bottom 0.762: v47.55,7.52 46.53,8.53 40.44,8.53 39.83,9.14 v39.83,14.63 39.83,24.79 39.83,31.05 | 39.83,31.05 C5.1 38.16,32.72 v36.98,32.72 35.36,34.34 29.87,34.34 28.65,35.56 v28.65,39.01 | 39.83,31.05 44.34,31.05 v44.5,30.89 | JP12.1 31.9,62.18 v29.67,59.94
3V3_CNTL
  Top 0.203: R22.1 63.63,58.28 Q1.1
3V3_DIS
  Top 0.762: D1.P2 64.61,67.23 C1.1 62.66,67.42 R25.2
3V3_EN
  Top 0.203: Q5.1 47.99,62.72 R23.1
3V3_IC
  Top 0.203: U6.P2 54.71,62.79 R28.1
  Top 0.762: U6.P2 54.71,64.87 55.07,65.23 57.05,65.23 C8.1 57.57,65.91 R30.2 56.66,68.4 | 56.66,68.4 D2.P2 | 56.66,68.4 56.78,68.4 R39.2
!CS
  Top 0.203: U4.P7 40.33,21.86 R17.2
!RD
  Top 0.203: U4.P11 36.33,20.18 R14.2
!RST
  Top 0.203: U4.P8 39.33,20.43 R13.2
A7  (via drill 0.41)
  Top 0.203: U3.P19 32.92,52.83 v34.54,54.46
  Bottom 0.203: U1.P19 58.36,52.39 55.68,55.07 44.09,55.07 43.89,55.27 39.62,55.27 39.01,54.66 34.75,54.66 v34.54,54.46
A8  (via drill 0.41)
  Top 0.203: v39.83,54.05 35.15,54.05 33.42,52.32 U3.P18
  Bottom 0.203: v39.83,54.05 40.44,54.66 43.69,54.66 43.89,54.46 55.47,54.46 57.71,52.22 U1.P18
A9  (via drill 0.41)
  Top 0.203: U3.P8 38.42,51.02 v39.62,52.22
  Bottom 0.203: v39.62,52.22 41.45,54.05 43.28,54.05 43.48,53.85 55.27,53.85 57.06,52.06 U1.P17
A10  (via drill 0.41)
  Top 0.203: U3.P7 38.92,49.28 38.81,49.17 v38.81,48.56
  Bottom 0.203: v38.81,48.56 38.81,50.39 41.86,53.44 43.08,53.44 43.28,53.24 55.07,53.24 56.41,51.9 U1.P16
A11  (via drill 0.41)
  Top 0.203: U3.P6 39.42,49.18 39.62,48.97 v39.62,47.75
  Bottom 0.203: v39.62,47.75 39.62,50.39 42.06,52.83 42.88,52.83 43.08,52.63 54.86,52.63 55.76,51.73 U1.P15
A12  (via drill 0.41)
  Top 0.203: v40.45,46.95 v40.44,46.94 40.44,48.77 39.92,49.28 U3.P5
  Bottom 0.203: U1.P14 55.11,51.57 54.66,52.02 43.08,52.02 42.67,52.22 42.27,52.22 40.44,50.39 v40.44,46.94
A13  (via drill 0.41)
  Top 0.203: v42.47,51.41 40.84,51.41 40.42,50.99 U3.P4
  Bottom 0.203: v42.47,51.41 53.85,51.41 54.46,50.8 U1.P13 | U1.P13
A14
  Top 0.203: U2.P13 57.71,46.94 56.9,46.13 42.27,46.13 40.92,47.47 U3.P3
A15
  Top 0.203: U2.P14 57.06,47.1 56.69,46.74 42.47,46.74 41.42,47.78 U3.P2
A16
  Top 0.203: U2.P15 56.41,47.26 56.29,47.14 42.88,47.14 41.92,48.1 U3.P1
A17
  Top 0.203: U2.P16 55.76,51.73 53.85,53.65 41.45,53.65 40.03,55.07 35.15,55.07 34.95,55.27 34.14,55.27 32.31,53.44 32.31,51.41 32.11,51.21 30.28,51.21 29.67,50.6 29.67,49.38 29.87,49.17 29.87,45.11 34.75,40.23 41.25,40.23 41.92,39.56 U3.P48
A18
  Top 0.203: U2.P17 55.11,51.57 53.65,53.03 34.75,53.03 33.92,52.21 U3.P17
A19  (via drill 0.41)
  Top 0.203: U2.P18 54.46,51.41 53.44,52.43 44.3,52.43 43.48,51.61 v43.48,48.77 | U3.P16 34.42,45.64 35.56,44.5 43.28,44.5 v43.48,44.7
  Bottom 0.203: v43.48,44.7 v43.48,48.77
A20  (via drill 0.41)
  Top 0.203: U2.P19 53.81,51.25 53.24,51.82 44.5,51.82 44.09,51.41 44.09,49.78 44.5,49.38 v44.5,47.95 | U3.P9 37.92,46.81 39.22,45.52 44.3,45.52 v44.5,45.31
  Bottom 0.203: v44.5,45.31 v44.5,47.95
AVCL
  Top 0.203: U8.P7 43.23,8.79 46.43,5.59 C13.1
AVDD
  Top 0.203: C12.1 47.77,5.27 47.77,5.47 45.63,7.61 U8.P4
FLASH_CE
  Top 0.203: R3.2 29.06,29.67 29.46,29.26 30.48,29.26 30.95,29.73 30.95,30.74 U3.P26
FLASH_RST  (via drill 0.41)
  Top 0.203: 36.45,51.89 v36.58,52.02 36.42,51.86 U3.P12
  Bottom 0.203: R4.1 36.82,51.78 v36.58,52.02
FLASH_WP  (via drill 0.41)
  Top 0.203: 35.45,51.93 v35.36,52.02 35.42,51.96 U3.P14
  Bottom 0.203: R1.1 35.15,48.29 35.15,51.82 v35.36,52.02
GND  (via drill 0.41)  (68 unrouted)
  other vias: 45.52,21.13 44.5,22.15 41.05,13.21 41.25,5.69 49.17,5.49 49.17,2.64 43.69,5.69 41.45,26.42
  pour Bottom: 0,0 73.66,0 73.66,76.2 0,76.2
  pour Top: 0,0 0,76.2 73.66,76.2 73.66,0
IM2
  Top 0.203: R15.2 44.5,26.42 44.09,26.01 42.88,26.01 42.33,25.46 U4.P5
LED_K
  Top 0.203: Q2.3 46.43,18.19 U4.P1
  Top 0.25: U8.P3 46.43,17.37 Q2.3
MOT_OUT
  Top 0.762: R24.1 17.49,64.52 JP11.2
MOT_OUT_INT
  Top 0.762: R24.2 15,62.28 Q3.3
N$1  (via drill 0.41)
  Top 0.203: v50.8,40.44 TP2.TP
  Bottom 0.203: U1.P9 53.81,40.19 53.44,39.83 51.41,39.83 v50.8,40.44
N$2
  Top 0.203: U2.P9 58.36,43.93 58.93,44.5 TP3.TP
N$4
  Top 0.203: U2.P12 58.36,46.9 58.73,46.53 60.35,46.53 60.96,47.14 TP35.TP
N$6
  Bottom 0.203: U1.P1 60.31,42.55 R5.1
N$7
  Top 0.203: U8.P12 39.23,7.71 39.62,7.32 43.69,7.32 44.77,6.24 R21.2
N$8
  Top 0.762: 36.17,66.04 L2.2 | 36.17,66.04 37.12,66.04 D3.P1 | U5.P5 36.49,65.72 36.17,66.04
N$9
  Top 0.203: U2.P1 53.16,41 R6.1
N$10
  Top 0.762: Q1.3 64.63,62.38 D1.P1 66.56,62.41 L1.2
N$11
  Top 0.203: U4.P2 45.33,25.42 46.04,26.12 R12.1
N$12
  Top 0.762: D2.P1 53.48,67.09 53.24,66.85 | 53.24,66.85 53.03,66.65 L3.2 | 53.71,66.52 U6.P5 | 53.71,66.52 53.65,66.45 | 53.71,66.52 53.58,66.52 53.24,66.85
N$13
  Top 0.203: U6.P1 53.82,63.85 R28.2 52.31,61.98 Q5.3
N$14
  Top 0.203: R34.1 23.37,43.7 | R34.1 R32.1 | U7.P5 20.89,43.2 21.34,42.75 22.23,42.75 23.45,43.97 R34.1 | R34.1 23.15,44.03
N$15
  Top 0.203: R20.1 48.2,8.49 47.23,9.46 U8.P2
N$16
  Top 0.203: R33.1 19.84,45.51 R31.1 22.09,45.46 U7.P4
N$17  (via drill 0.41)
  Top 0.203: v53.03,50.6 52.83,50.8 48.16,50.8 47.55,50.19 TP36.TP
  Bottom 0.203: U1.P12 53.81,49.82 v53.03,50.6
N$19
  Top 0.203: U8.P15 36.83,6.66 38.1,5.38 R27.2
N$20
  Top 0.203: U8.P13 38.43,7.29 39.22,6.5 41.86,6.5 42.55,5.82 R35.2
N$21
  Top 0.203: U8.P14 37.63,6.87 38.61,5.89 39.62,5.89 40.32,5.19 R36.1
N$22
  Top 0.203: R37.1 35.88,7.32 36.17,7.61 36.17,8.53 36.03,8.67 U8.P16
NB_IN_0
  Top 0.203: R7.2 62.4,21.12 JP4.4
NB_IN_1
  Top 0.203: JP4.3 R8.2
NB_IN_2
  Top 0.203: JP4.2 R9.2
NB_IN_3
  Top 0.203: JP4.1 R10.2
P0.0  (via drill 0.41)
  Top 0.203: U8.P26 28.03,14.85 v27.43,15.44 | v36.98,15.65 37.33,15.99 U4.P10 37.33,26.36 38.81,27.84 v41.05,27.84 | R2.1 34.54,60.76 v36.98,58.32 | v62.99,31.29 TP4.TP 64.62,44.5 67.26,44.5 JP2.7
  Bottom 0.203: v27.43,15.44 36.78,15.44 v36.98,15.65 | v41.05,27.84 59.54,27.84 v62.99,31.29 | v36.98,58.32 59.74,58.32 62.99,55.07 62.99,48.77 JP2.7
P0.1  (via drill 0.41)
  Top 0.203: U2.P8 57.71,41.05 v58.73,40.03 59.74,39.01 v59.74,33.93 59.74,32.72 62.38,30.07 TP5.TP 62.4,27.42 R7.1 | U3.P45 40.42,33.1 v40.44,33.12
  Bottom 0.203: JP2.8 68.68,43.28 66.85,43.28 66.04,42.47 66.04,41.66 64.82,40.44 64.82,39.62 64.41,39.22 59.54,39.22 v58.73,40.03 58.36,40.4 U1.P2 | 59.54,34.14 v59.74,33.93 59.54,33.73 41.05,33.73 v40.44,33.12
P0.2  (via drill 0.41)
  Top 0.203: U2.P7 57.06,40.27 v58.52,38.81 58.73,38.61 58.73,31.09 59.83,29.98 TP6.TP 59.75,27.32 R8.1 | v38.61,37.59 38,37.59 36.78,36.37 32.11,36.37 30.42,34.69 U3.P25
  Bottom 0.203: JP2.9 67.11,41.91 65.43,40.23 65.43,39.42 64.62,38.61 58.73,38.61 v58.52,38.81 57.71,39.62 U1.P3 57.71,45.31 56.69,46.33 47.14,46.33 38.61,37.8 v38.61,37.59
P0.3  (via drill 0.41)
  Top 0.203: U2.P6 56.41,39.7 v57.3,38.81 58.12,38 58.12,31.09 57.19,30.16 TP7.TP 57.21,27.43 R9.1 | v42.88,40.84 34.95,40.84 30.95,45.05 30.42,45.58 U3.P24
  Bottom 0.203: JP2.10 69.85,41.81 68.68,40.64 66.65,40.64 66.04,40.03 66.04,39.22 64.82,38 58.12,38 v57.3,38.81 57.06,39.05 U1.P4 57.06,44.95 56.29,45.72 47.35,45.72 42.88,41.25 v42.88,40.84
P0.4  (via drill 0.41)
  Top 0.203: U2.P5 55.76,38.93 v57.1,37.59 57.1,32.51 54.75,30.16 TP8.TP 54.67,27.42 R10.1 | v44.5,41.66 35.15,41.66 30.92,45.89 U3.P23
  Bottom 0.203: JP2.11 67.21,39.37 65.23,37.59 65.02,37.39 57.3,37.39 v57.1,37.59 56.41,38.08 U1.P5 56.41,44.38 55.68,45.11 47.55,45.11 44.5,42.06 v44.5,41.66
P0.5  (via drill 0.41)
  Top 0.203: U2.P4 55.11,38.36 v55.88,37.59 56.49,36.98 56.49,34.54 TP9.TP | v46.13,42.47 35.15,42.47 32,45.62 31.95,45.68 31.42,46.2 U3.P22
  Bottom 0.203: JP2.12 68.48,38 66.65,38 65.43,36.78 56.69,36.78 v55.88,37.59 55.76,37.71 U1.P6 55.76,44.01 55.27,44.5 47.75,44.5 46.13,42.88 v46.13,42.47
P0.6  (via drill 0.41)
  Top 0.203: U2.P3 54.46,37.59 v55.68,36.37 55.68,35.36 54.25,33.93 TP10.TP | v47.75,43.28 35.15,43.28 31.92,46.52 U3.P21
  Bottom 0.203: JP2.13 66.65,36.17 55.88,36.17 v55.68,36.37 55.11,36.94 U1.P7 55.11,43.44 54.66,43.89 48.36,43.89 v47.75,43.28
P0.7  (via drill 0.41)
  Top 0.203: TP11.TP 52.87,33.97 54.46,35.56 v54.46,36.58 53.81,37.23 U2.P2 53.81,43.73 53.44,44.09 47.35,44.09 47.14,43.89 35.36,43.89 32.42,46.83 U3.P20
  Bottom 0.203: JP2.14 69.85,36.73 68.68,35.56 55.47,35.56 v54.46,36.58 U1.P8
P1.0
  Top 0.203: JP6.2 59.35,16.46 TP12.TP 63.86,16.51 JP2.29
P1.1
  Top 0.203: 54.46,3.28 TP13.TP 54.46,9.96 57.1,12.6 70.51,12.6 71.32,13.41 71.32,15.04 JP2.30 | 54.46,3.28 54.46,3.25 | JP3.1 54.46,3.28
P1.2  (via drill 0.41)
  Top 0.203: v23.77,47.93 22.85,47.93 R31.2 22.13,48.84 TP14.TP
  Bottom 0.203: JP2.31 53.59,13.97 50.8,11.18 50.8,7.72 49.58,6.5 36.98,6.5 36.17,5.69 26.21,5.69 24.38,7.52 24.38,25.81 20.12,30.07 10.77,30.07 9.96,30.89 9.96,38.81 11.58,40.44 24.99,40.44 25.4,40.84 25.4,47.52 24.99,47.93 v23.77,47.93
P1.3  (via drill 0.41)
  Top 0.203: R32.2 25.46,42.33 v24.59,41.45 25.86,40.18 TP15.TP
  Bottom 0.203: JP2.32 68.48,12.6 53.85,12.6 52.02,10.77 52.02,6.5 50.19,4.67 25.81,4.67 23.16,7.32 23.16,25.4 19.51,29.06 10.36,29.06 9.14,30.28 9.14,39.42 10.97,41.25 24.38,41.25 v24.59,41.45
P1.4
  Top 0.203: JP2.33 58.98,11.43 56.9,9.35 TP16.TP 56.9,3.38 JP3.2
P1.5
  Top 0.203: JP2.34 69.75,11.43 68.48,10.16 60.76,10.16 59.33,8.74 TP17.TP 59.33,3.48 JP3.3
P1.6
  Top 0.203: JP3.4 62.03,6.25 TP18.TP 61.98,8.33 62.53,8.89 JP2.35
P1.7
  Top 0.203: JP2.36 71.73,10.77 71.73,58.32 70.71,59.33 62.22,59.33 R22.2 60.92,59.33 48.36,59.33 47.95,59.74 47.95,60.96 | 45.86,61.16 TP19.TP 45.88,60.96 47.95,60.96 | 47.95,60.96 R23.2
P2.0
  Top 0.203: TP20.TP 8.15,17.68 7.62,17.14 | U4.P19 28.33,26.09 32.42,29.98 U3.P29
  Top 0.25: JP1.29 5.08,17.78 6.99,17.78 7.62,17.14 7.62,16.51 8.89,15.24 8.89,14.61 11.75,11.75 11.75,10.16 15.56,6.35 27.94,6.35 28.83,7.24 U8.P25 28.83,21.02 28.33,21.52 U4.P19
P2.1  (via drill 0.41)
  Top 0.203: TP21.TP 9.36,16.07 v9.35,16.05 | U4.P18 29.33,25.88 33.42,29.96 U3.P31
  Top 0.25: JP1.30 6.67,16.51 8.26,14.92 8.26,14.29 11.11,11.43 11.11,9.84 15.24,5.71 28.26,5.71 29.63,7.09 U8.P24 29.63,21.73 29.33,22.03 U4.P18
  Bottom 0.203: v9.35,16.05 6.81,16.05 JP1.30
P2.2  (via drill 0.41)
  Top 0.203: v10.36,14.63 TP22.TP | U4.P17 30.33,25.86 34.42,29.95 U3.P33
  Top 0.25: JP1.31 5.08,15.24 6.99,15.24 7.62,14.61 7.62,13.97 10.48,11.11 10.48,9.53 14.92,5.08 28.79,5.08 30.43,6.72 U8.P23 30.33,11.21 U4.P17
  Bottom 0.203: JP1.31 5.08,15.24 6.91,15.24 7.52,14.63 v10.36,14.63
P2.3  (via drill 0.41)
  Top 0.203: TP23.TP 11.57,13.22 v11.38,13.41 | U4.P16 31.33,25.84 35.42,29.93 U3.P35
  Top 0.25: JP1.32 6.67,13.97 9.84,10.79 9.84,9.21 14.61,4.45 29.21,4.45 31.23,6.46 U8.P22 31.23,22.34 31.33,22.44 U4.P16
  Bottom 0.203: 6.5,14.02 JP1.32 6.91,13.41 v11.38,13.41
P2.4  (via drill 0.41)
  Top 0.203: TP24.TP 13.01,11.79 v12.6,12.19 | U4.P15 32.33,25.42 36.92,30.01 U3.P38
  Top 0.25: JP1.33 5.08,12.7 6.99,12.7 9.21,10.48 9.21,8.89 14.29,3.81 29.84,3.81 32.07,6.03 32.07,11.07 U8.P21 32.03,21.98 32.33,22.28 U4.P15
  Bottom 0.203: v12.6,12.19 7.49,12.19 6.99,12.7 5.08,12.7 JP1.33
P2.5  (via drill 0.41)
  Top 0.203: TP25.TP 13.61,10.57 v13.41,10.77 | U4.P14 33.33,25.41 37.92,30 U3.P40 | 8.46,9.96 8.46,10.24 7.92,10.77 7.01,10.77 JP1.34
  Top 0.25: 8.46,9.96 8.46,8.69 13.97,3.17 30.48,3.17 32.83,5.53 U8.P20 32.83,21.72 33.34,22.23 33.34,24.12 U4.P14
  Bottom 0.203: v13.41,10.77 7.01,10.77 JP1.34
P2.6  (via drill 0.41)
  Top 0.203: U4.P13 34.33,25.39 38.92,29.98 U3.P42 38.95,30.79 | TP26.TP 14.58,9.4 v14.43,9.55
  Top 0.25: JP1.35 5.08,10.16 6.99,10.16 7.62,9.53 7.62,8.57 13.65,2.54 31.11,2.54 33.66,5.08 33.66,11.09 U8.P19 33.66,11.14 33.66,21.59 34.33,22.27 U4.P13
  Bottom 0.203: v14.43,9.55 7.59,9.55 6.99,10.16 5.08,10.16 JP1.35
P2.7  (via drill 0.41)
  Top 0.203: U4.P12 35.33,25.37 39.92,29.96 U3.P44 | TP27.TP 15.44,8.13 v15.24,8.33
  Top 0.25: JP1.36 13.34,1.91 31.75,1.91 34.43,4.58 U8.P18 34.43,21.41 35.33,22.31 U4.P12
  Bottom 0.203: v15.24,8.33 6.91,8.33 JP1.36
P3.0  (via drill 0.41)
  Top 0.203: JP1.7 3.2,44.45 2.03,43.28 2.03,39.22 3.25,38 12.6,38 14.63,35.97 TP28.TP 25.4,25.11 25.4,15.65 v27.23,13.82 U8.P27 | U4.P9 38.33,15.16 v36.98,13.82
  Bottom 0.203: v27.23,13.82 v36.98,13.82
P3.1  (via drill 0.41)
  Top 0.203: JP1.8 8.04,44.45 TP29.TP 9.46,47.87 v12.6,51
  Bottom 0.203: v12.6,51 15.04,53.44 36.37,53.44 38,51.82 38,48.16 40.23,45.92 40.64,45.92 41.25,46.53 41.25,47.35 41.05,47.55 41.05,50.19 41.45,50.6 42.88,50.6 43.08,50.8 51.82,50.8 52.14,50.47 52.14,49.05 52.63,48.56 53.08,48.56 U1.P11
P3.2  (via drill 0.41)
  Top 0.203: TP30.TP 9.75,43.08 5.08,43.08 3.86,41.86 JP1.9 | v57.51,54.46 57.71,54.25 57.91,52.83 59.01,51.74 U2.P11
  Bottom 0.203: JP1.9 3.91,41.91 4.98,42.98 9.65,42.98 TP30.TP 10.97,51.61 13.41,54.05 32.92,54.05 34.14,55.27 38.81,55.27 39.42,55.88 44.09,55.88 44.3,55.68 55.88,55.68 57.1,54.46 v57.51,54.46
P3.3
  Top 0.203: JP1.10 11.63,41.91 12.8,43.08 12.8,46.09 TP31.TP 12.71,47.87 14.04,49.19 Q3.1
P3.4  (via drill 0.41)  (1 unrouted)
  Top 0.203: JP1.11 5.08,40.64 13.61,40.64 14.83,41.86 14.83,47.46 TP32.TP | Q2.1 48.94,11.81 50.19,10.57 v53.65,10.57
  Bottom 0.203: JP1.11 2.44,38 2.44,28.65 3.25,27.84 19.3,27.84 22.15,24.99 22.15,7.11 25.6,3.66 50.8,3.66 53.24,6.1 53.24,10.16 v53.65,10.57
P3.5  (via drill 0.41)
  Top 0.203: JP1.12 13.66,39.37 14.43,38.61 TP33.TP 15.44,37.39 v19.1,37.39 | v21.74,38 36.58,38 v37.39,38.81 | U3.P11 36.92,46.19 v37.8,45.31
  Bottom 0.203: v37.8,45.31 37.8,39.22 v37.39,38.81 | v19.1,37.39 21.13,37.39 v21.74,38
P3.6  (via drill 0.41)
  Top 0.203: JP1.13 5.08,35.56 TP34.TP v15.04,33.12 | v31.9,32.51 31.95,32.47 31.95,30.79 U3.P28
  Bottom 0.203: v15.04,33.12 31.09,33.33 v31.9,32.51
SDA_LCD
  Top 0.203: U4.P6 41.33,22.07 42.06,21.34 43.19,21.34 R16.1
VBATT  (via drill 0.41)
  Top 0.762: R2.2 31.5,60.79 31.5,71.42 JP10.1 31.76,71.16 R19.2 33.97,71.12 v35.36,71.12 | R26.2 44.87,67.63 v45.11,67.87
  Bottom 0.762: v45.11,67.87 36.17,67.87 35.56,68.48 35.56,70.92 v35.36,71.12
VBATT_EXT
  Top 0.762: R19.1 33.93,66.13 L2.1
VCC
  Top 0.762: JP2.3 JP2.1
VEXT
  Top 0.762: JP1.3 JP1.1
VTG
  Top 0.762: JP1.4 JP1.2
VTG_NRF
  Top 0.762: JP2.4 69.93,49.61 69.93,51.99 JP2.2 69.85,54.75 R11.2

### Text on the board
Top: TBC Dev. V1 | JW 2011 | SST
tPlace: MOTOR